# Altium schematic sheet Res 100K 805.schdoc
size 127 x 99 mm
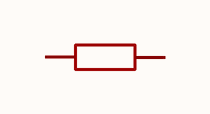
[diagram p0: Res 100K 805.schdoc]

## Parts
R?  100kΩ  [R0805]  (value not drawn)

## Nets

Not connected (* = marked no-connect by the designer): R? 1 2

## Library data of the parts
R? = ERJ6ENF1003V: Manufacturer: PANASONIC(松下); Add into BOM: yes; Tolerance: ±1%; Temperature Coefficient: ±100ppm/℃; Symbol: ERJ6ENF1003V; Device: ERJ6ENF1003V; LCSC Part Name: 100kΩ ±1% 125mW 厚膜电阻; Supplier Part: C169252; Manufacturer Part: ERJ6ENF1003V; Supplier Footprint: 0805; JLCPCB Part Class: Extended Part; Datasheet: https://atta.szlcsc.com/upload/public/pdf/source/20181222/C169252_7F18A762E4E3D9CA9CBEEE198C53D3F1.pdf; Supplier: LCSC; Convert to PCB: yes; Type: Thick Film Resistors; Value: 100kΩ; Overload Voltage (Max): -; Operating Temperature Range: -55℃~+155℃